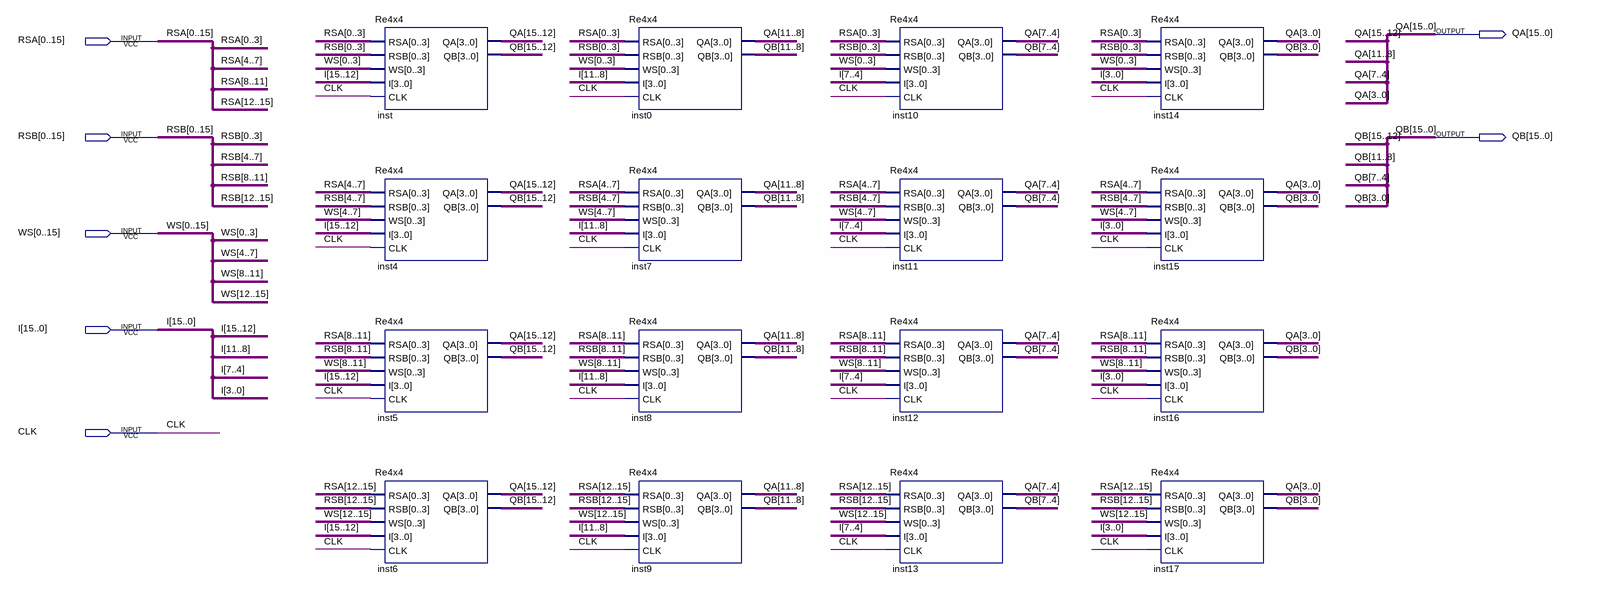
[diagram p0: schematic sheet]
// Quartus schematic Re16x16.bdf as structural Verilog: 16 symbols, 7 pins
module Re16x16 (
  input  [0:15] RSA,
  input  [0:15] RSB,
  input  [0:15] WS,
  input  [15:0] I,
  input  CLK,
  output [15:0] QA,
  output [15:0] QB
);

  Re4x4 inst (.RSA(RSA[0:3]), .RSB(RSB[0:3]), .WS(WS[0:3]), .I(I[15:12]), .CLK(CLK), .QA(QA[15:12]), .QB(QB[15:12]));
  Re4x4 inst4 (.RSA(RSA[4:7]), .RSB(RSB[4:7]), .WS(WS[4:7]), .I(I[15:12]), .CLK(CLK), .QA(QA[15:12]), .QB(QB[15:12]));
  Re4x4 inst5 (
    .RSA(RSA[8:11]), .RSB(RSB[8:11]), .WS(WS[8:11]), .I(I[15:12]), .CLK(CLK), .QA(QA[15:12]), .QB(QB[15:12]));
  Re4x4 inst6 (
    .RSA(RSA[12:15]), .RSB(RSB[12:15]), .WS(WS[12:15]), .I(I[15:12]), .CLK(CLK), .QA(QA[15:12]),
    .QB(QB[15:12]));
  Re4x4 inst0 (.RSA(RSA[0:3]), .RSB(RSB[0:3]), .WS(WS[0:3]), .I(I[11:8]), .CLK(CLK), .QA(QA[11:8]), .QB(QB[11:8]));
  Re4x4 inst7 (.RSA(RSA[4:7]), .RSB(RSB[4:7]), .WS(WS[4:7]), .I(I[11:8]), .CLK(CLK), .QA(QA[11:8]), .QB(QB[11:8]));
  Re4x4 inst8 (.RSA(RSA[8:11]), .RSB(RSB[8:11]), .WS(WS[8:11]), .I(I[11:8]), .CLK(CLK), .QA(QA[11:8]), .QB(QB[11:8]));
  Re4x4 inst9 (
    .RSA(RSA[12:15]), .RSB(RSB[12:15]), .WS(WS[12:15]), .I(I[11:8]), .CLK(CLK), .QA(QA[11:8]), .QB(QB[11:8]));
  Re4x4 inst10 (.RSA(RSA[0:3]), .RSB(RSB[0:3]), .WS(WS[0:3]), .I(I[7:4]), .CLK(CLK), .QA(QA[7:4]), .QB(QB[7:4]));
  Re4x4 inst11 (.RSA(RSA[4:7]), .RSB(RSB[4:7]), .WS(WS[4:7]), .I(I[7:4]), .CLK(CLK), .QA(QA[7:4]), .QB(QB[7:4]));
  Re4x4 inst12 (.RSA(RSA[8:11]), .RSB(RSB[8:11]), .WS(WS[8:11]), .I(I[7:4]), .CLK(CLK), .QA(QA[7:4]), .QB(QB[7:4]));
  Re4x4 inst13 (.RSA(RSA[12:15]), .RSB(RSB[12:15]), .WS(WS[12:15]), .I(I[7:4]), .CLK(CLK), .QA(QA[7:4]), .QB(QB[7:4]));
  Re4x4 inst14 (.RSA(RSA[0:3]), .RSB(RSB[0:3]), .WS(WS[0:3]), .I(I[3:0]), .CLK(CLK), .QA(QA[3:0]), .QB(QB[3:0]));
  Re4x4 inst15 (.RSA(RSA[4:7]), .RSB(RSB[4:7]), .WS(WS[4:7]), .I(I[3:0]), .CLK(CLK), .QA(QA[3:0]), .QB(QB[3:0]));
  Re4x4 inst16 (.RSA(RSA[8:11]), .RSB(RSB[8:11]), .WS(WS[8:11]), .I(I[3:0]), .CLK(CLK), .QA(QA[3:0]), .QB(QB[3:0]));
  Re4x4 inst17 (.RSA(RSA[12:15]), .RSB(RSB[12:15]), .WS(WS[12:15]), .I(I[3:0]), .CLK(CLK), .QA(QA[3:0]), .QB(QB[3:0]));
endmodule
